# Altium schematic sheet QCopterMV_LED_Sch.SchDoc: QCopterMV-LED
size 127 x 101 mm; Author: Hom; CompanyName: KitSprout; DrawnBy: Hom; Engineer: Hom; Organization: KitSprout; Revision: A; SheetNumber: 1; SheetTotal: 1; Version: 2.0; LibVersion: 2.7
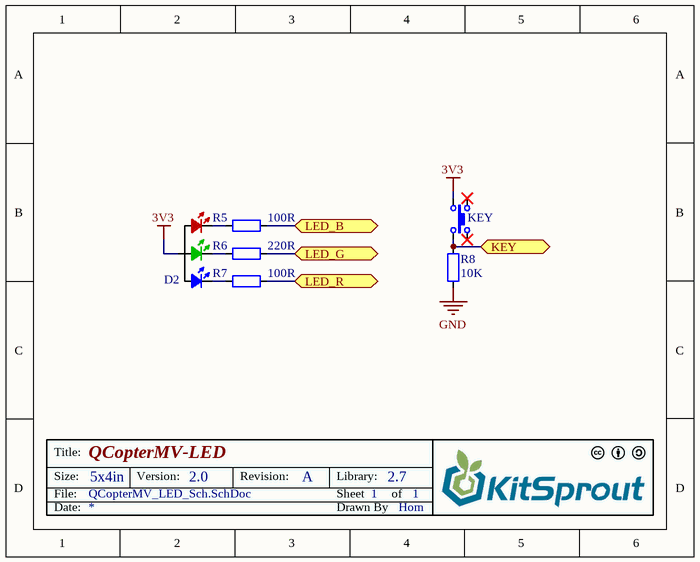
[diagram p0: QCopterMV_LED_Sch.SchDoc]

## Parts
D2  LED_3528_RGB  [LED_3528_RGB]  (value not drawn)
KEY  ButtonTACT  [ButtonTACT_3.5*3.55_90]  (value not drawn)
R5  value 100R  [RES_0603]  (hidden comment: Res_0603)
R6  value 220R  [RES_0603]  (hidden comment: Res_0603)
R7  value 100R  [RES_0603]  (hidden comment: Res_0603)
R8  value 10K  [RES_0603]  (hidden comment: Res_0603)

## Ports
KEY, LED_B, LED_G, LED_R

## Nets
3V3: D2.2(A) KEY.3
GND: R8.1
KEY: KEY.4 R8.2 ; port KEY
LED_B: R5.2 ; port LED_B
LED_G: R6.2 ; port LED_G
LED_R: R7.2 ; port LED_R
NetD2_1: D2.1(R) R5.1
NetD2_3: D2.3(G) R6.1
NetD2_4: D2.4(B) R7.1

Not connected (* = marked no-connect by the designer): KEY 1* 2*

## Notes on the sheet
- Title:
- Size:
- Date:
- File:
- 5x4in
- Version:
- Revision:
- Sheet
- Drawn By
- Library:
- of

## Library data of the parts
D2 = LED_3528_RGB: LED
KEY = ButtonTACT: Button
R5-R8 = Res_0603: Resistor